# EAGLE design Apex_CV_Expander_3U_v1.0 (EAGLE 9.6.0)
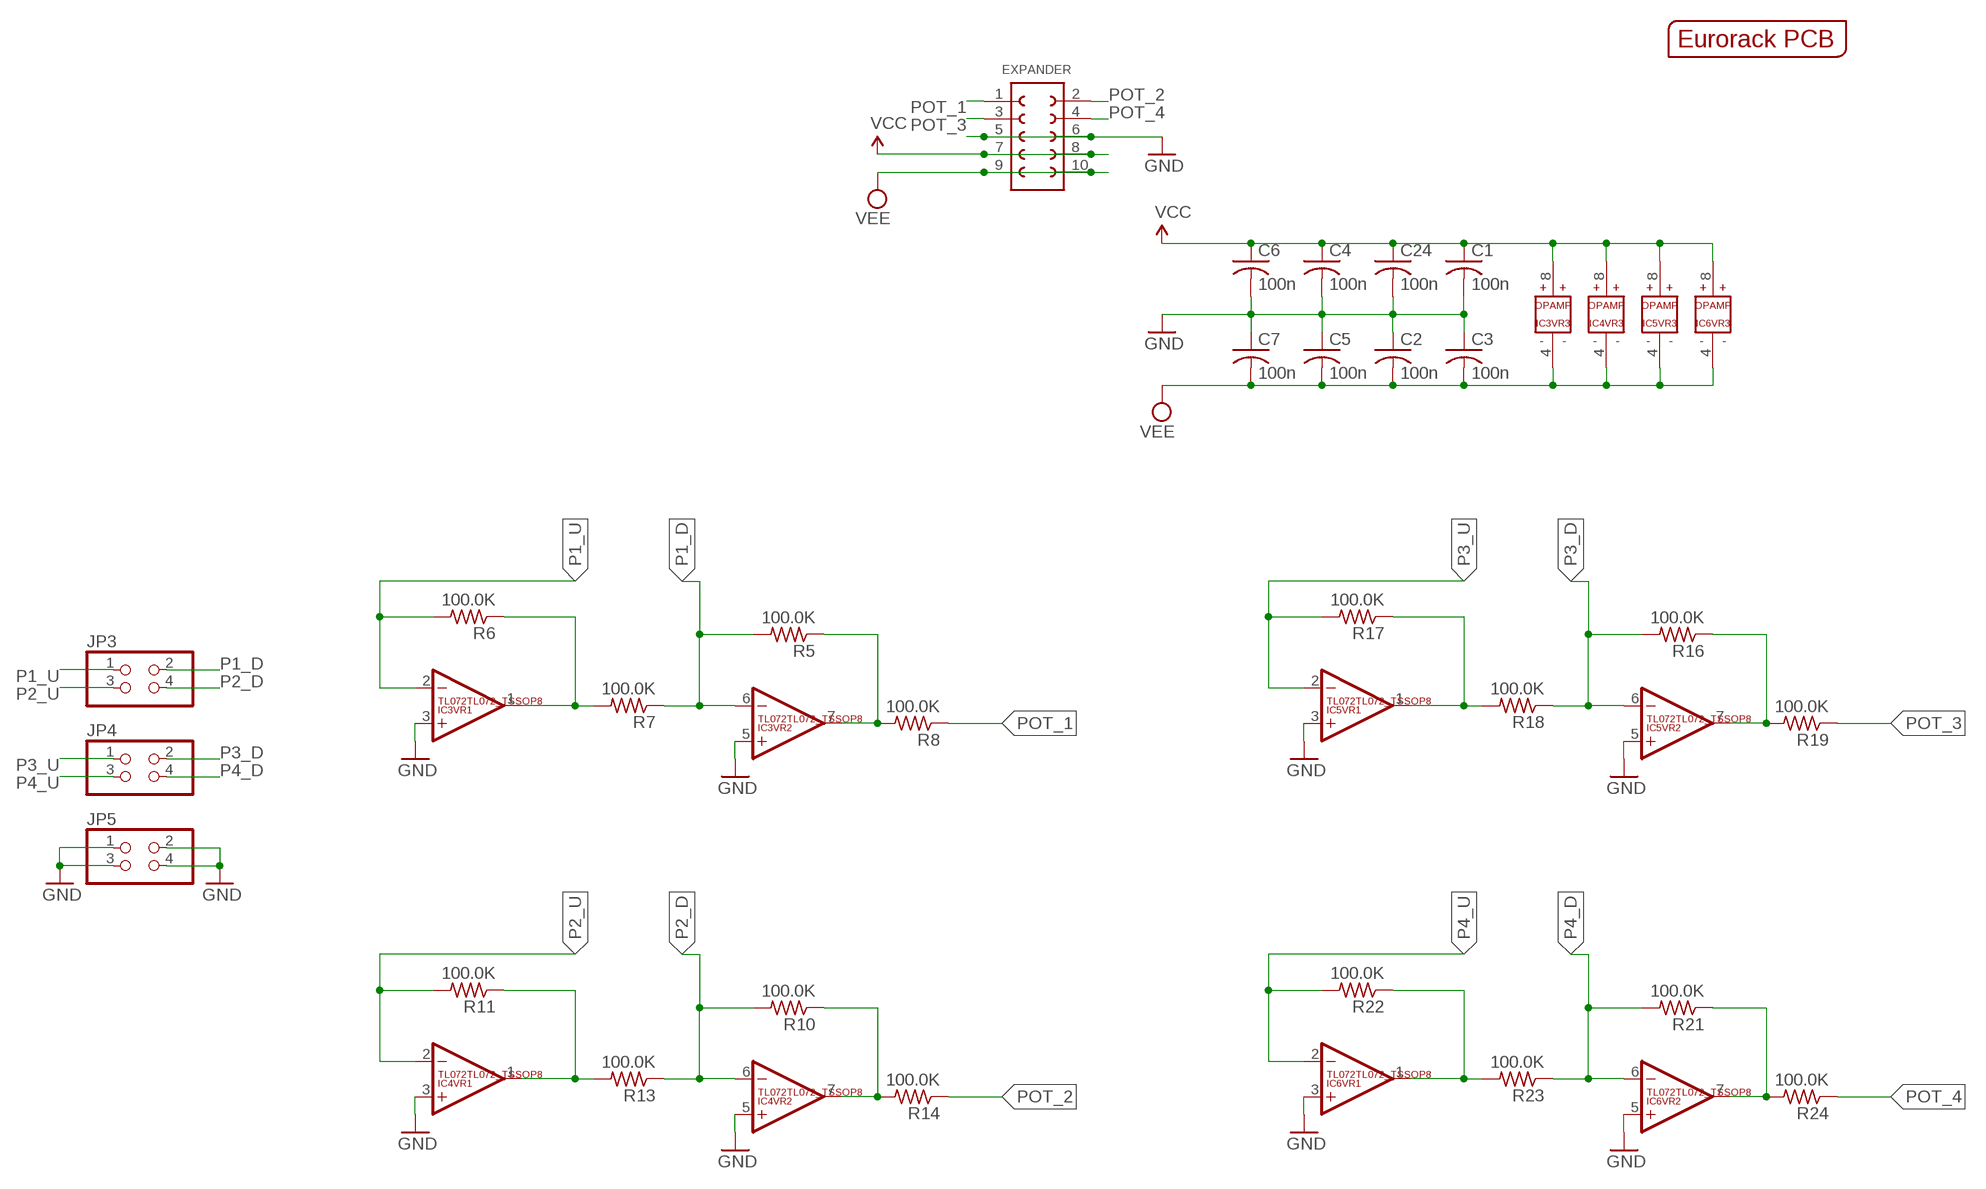
[diagram p0: schematic, sheet 1]

## Parts
C1  100n  C-USC0603  [C0603]
C2  100n  C-USC0603  [C0603]
C3  100n  C-USC0603  [C0603]
C4  100n  C-USC0603  [C0603]
C5  100n  C-USC0603  [C0603]
C6  100n  C-USC0603  [C0603]
C7  100n  C-USC0603  [C0603]
C24  100n  C-USC0603  [C0603]
EXPANDER  61301021121  [61301021121]
IC3  TL072TL072_TSSOP8  [TL072_TSSOP8]
IC4  TL072TL072_TSSOP8  [TL072_TSSOP8]
IC5  TL072TL072_TSSOP8  [TL072_TSSOP8]
IC6  TL072TL072_TSSOP8  [TL072_TSSOP8]
JP3  PINHD-2X2  [2X02]
JP4  PINHD-2X2  [2X02]
JP5  PINHD-2X2  [2X02]
PCB1  EURORACK_PCB2HP  [EURORACK2HPPCB]
R5  100.0K  R-US_R0603  [R0603]
R6  100.0K  R-US_R0603  [R0603]
R7  100.0K  R-US_R0603  [R0603]
R8  100.0K  R-US_R0603  [R0603]
R10  100.0K  R-US_R0603  [R0603]
R11  100.0K  R-US_R0603  [R0603]
R13  100.0K  R-US_R0603  [R0603]
R14  100.0K  R-US_R0603  [R0603]
R16  100.0K  R-US_R0603  [R0603]
R17  100.0K  R-US_R0603  [R0603]
R18  100.0K  R-US_R0603  [R0603]
R19  100.0K  R-US_R0603  [R0603]
R21  100.0K  R-US_R0603  [R0603]
R22  100.0K  R-US_R0603  [R0603]
R23  100.0K  R-US_R0603  [R0603]
R24  100.0K  R-US_R0603  [R0603]

## Nets
GND: C1.2 C2.1 C3.1 C4.2 C5.1 C6.2 C7.1 C24.2 EXPANDER.5 EXPANDER.6 IC3.3(VR1:+IN) IC3.5(VR2:+IN) IC4.3(VR1:+IN) IC4.5(VR2:+IN) IC5.3(VR1:+IN) IC5.5(VR2:+IN) IC6.3(VR1:+IN) IC6.5(VR2:+IN) JP5.1 JP5.2 JP5.3 JP5.4
N$4: IC3.7(VR2:OUT) R5.1 R8.2
N$6: IC3.1(VR1:OUT) R6.1 R7.2
N$10: IC4.7(VR2:OUT) R10.1 R14.2
N$12: IC4.1(VR1:OUT) R11.1 R13.2
N$16: IC5.7(VR2:OUT) R16.1 R19.2
N$18: IC5.1(VR1:OUT) R17.1 R18.2
N$22: IC6.7(VR2:OUT) R21.1 R24.2
N$24: IC6.1(VR1:OUT) R22.1 R23.2
P1_D: IC3.6(VR2:-IN) JP3.2 R5.2 R7.1
P1_U: IC3.2(VR1:-IN) JP3.1 R6.2
P2_D: IC4.6(VR2:-IN) JP3.4 R10.2 R13.1
P2_U: IC4.2(VR1:-IN) JP3.3 R11.2
P3_D: IC5.6(VR2:-IN) JP4.2 R16.2 R18.1
P3_U: IC5.2(VR1:-IN) JP4.1 R17.2
P4_D: IC6.6(VR2:-IN) JP4.4 R21.2 R23.1
P4_U: IC6.2(VR1:-IN) JP4.3 R22.2
POT_1: EXPANDER.1 R8.1
POT_2: EXPANDER.2 R14.1
POT_3: EXPANDER.3 R19.1
POT_4: EXPANDER.4 R24.1
VCC: C1.1 C4.1 C6.1 C24.1 EXPANDER.7 EXPANDER.8 IC3.8(VR3:V+) IC4.8(VR3:V+) IC5.8(VR3:V+) IC6.8(VR3:V+)
VEE: C2.2 C3.2 C5.2 C7.2 EXPANDER.9 EXPANDER.10 IC3.4(VR3:V-) IC4.4(VR3:V-) IC5.4(VR3:V-) IC6.4(VR3:V-)

## Library data of the parts
C1-C7 C24 = rcl:C-US: CAPACITOR, American symbol
EXPANDER = Wurth_Elektronik_Electromechanic_Board_to_Board_Connectors_rev18b:61301021121: WR-PHD 2.54mm Dual Pin Header, 10 Pins =>Code : Con_BTB_PHD_2.54_2_61301021121 <http://katalog.we-online.de/media/images/eican/Con_BTB_PHD_2.54_2_6130xx21121_pf2.jpg> Details see: http://katalog.we-online.de/en/em/613_0xx_211_21 Created 2014-05-29, Karrer Zheng 2014 (C) Würth Elektronik
IC3-IC6 = EurorackModularParts:TL072
JP3-JP5 = pinhead:PINHD-2X2: PIN HEADER
PCB1 = EurorackModularParts:EURORACK_PCB
R5-R8 R10 R11 R13 R14 R16-R19 R21-R24 = rcl:R-US_: RESISTOR, American symbol

## Board
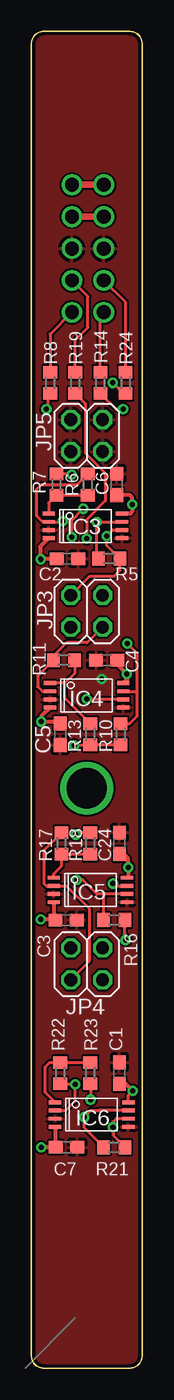
[diagram p1: board, top side]
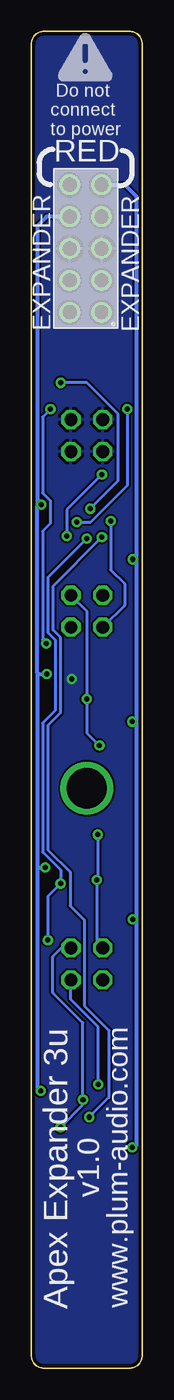
[diagram p2: board, bottom side, seen from below]

Size 8.82 x 106.5 mm. Coordinates in mm from the lower left corner, seen from the top.
Copper layers (1*16): Top 0.035mm / dielectric 1.5mm / Bottom 0.035mm
Design rules "default *": minimum track width 6mil, minimum drill 0.4mm, track to track 6mil, track to pad 6mil, pad to pad 6mil, via to via 6mil, smd to smd 6mil, copper to edge 10mil, drill to drill 6mil, minimum pad ring 10mil, minimum via ring 8mil, stop-mask expansion 4mil, vias tented up to drill 25mil, thermal gap 10mil

### Footprints (pad centres in the part's own frame; a part is rotated, then mirrored left to right if it is on the bottom)
C0603 = smd 1.1 x 1: 1 -0.85,0; 2 0.85,0
61301021121 = drill 1.1: 1 -5.08,-1.27; 2 -5.08,1.27; 3 -2.54,-1.27; 4 -2.54,1.27; 5 0,-1.27; 6 0,1.27; 7 2.54,-1.27; 8 2.54,1.27; 9 5.08,-1.27; 10 5.08,1.27
TL072_TSSOP8 = smd 0.305 x 0.991: 1 -0.975,-2.918; 2 -0.325,-2.918; 3 0.325,-2.918; 4 0.975,-2.918; 5 0.975,2.918; 6 0.325,2.918; 7 -0.325,2.918; 8 -0.975,2.918
2X02 = drill 1.016 octagon: 1 -1.27,-1.27; 2 -1.27,1.27; 3 1.27,-1.27; 4 1.27,1.27
R0603 = smd 1 x 1.1: 1 -0.85,0; 2 0.85,0

### Placement (x,y rotation side)
C1  7,23.5 90 top
C2  2.87,64.49 180 top
C3  2.77,35.7 180 top
C4  6,56.4 180 top
C5  2.3,50.5 90 top
C6  6.8,70.4 90 top
C7  2.8,17.6 180 top
C24  7.01,41.81 90 top
EXPANDER  4.5,89.2 90 bottom
IC3  4.3,67.1 270 top
IC4  4.4,53.6 270 top
IC5  4.7,38.1 270 top
IC6  4.8,20.2 270 top
JP3  4.4,60.3 0 top
JP4  4.4,32.2 0 top
JP5  4.4,74.3 0 top
PCB1  -0.5,0 0 top
R5  6.2,64.5 0 top
R6  4.5,70.4 90 top
R7  2,70.4 270 top
R8  1.5,78.5 270 top
R10  7.1,50.5 270 top
R11  2.6,56.4 180 top
R13  4.7,50.5 90 top
R14  5.5,78.5 270 top
R16  6.6,35.7 180 top
R17  2.4,41.8 90 top
R18  4.7,41.8 270 top
R19  3.5,78.5 270 top
R21  6.6,17.6 0 top
R22  2.3,23.5 270 top
R23  4.7,23.5 90 top
R24  7.5,78.5 270 top

### Tracks (layer width: path | path; a pad name or v marks a point on that pad's centre or on a via)
GND  (via drill 0.4)
  other vias: 5.6,54.9
  pour Bottom: 0,0 0,106.5 1.2,106.5 8.8,106.5 8.8,104.8 8.8,0
  pour Top: 0,0 0,106.5 1.2,106.5 8.8,106.5 8.8,104.8 8.8,0
N$1  (via drill 3.2)
  other vias: 4.4,46.2
N$4  (via drill 0.4)
  Top 0.254: R8.2 1.3,77.45 1.3,76.5 v1.2,76.4 | IC3.7 5.22,67.42 v5.2,67.4 5.2,64.65 R5.1
  Bottom 0.254: v1.2,76.4 1.2,70.3 4.1,67.4 v5.2,67.4
N$6
  Top 0.254: IC3.1 1.38,68.93 R7.2 R6.1
N$10  (via drill 0.4)
  Top 0.254: R14.2 6.75,76.4 v7.3,76.4 | v7.63,57.73 8.38,56.98 8.38,53.9 | 7.34,53.9 IC4.7 8.35,53.92 8.38,53.9 | 8.38,53.9 8.38,51.9 7.82,51.35 R10.1
  Bottom 0.254: v7.3,76.4 7.92,75.78 7.92,69.72 7.3,69.1 7.3,67.3 7.92,66.68 7.92,58.02 v7.63,57.73
N$12
  Top 0.254: R11.1 3.45,55.35 2.67,54.58 | 2.67,54.58 IC4.1 | R13.2 2.67,53.38 2.67,54.58
N$16  (via drill 0.4)
  Top 0.254: R19.2 4.3,76.85 4.3,72.9 5.9,71.3 5.9,69.1 4.4,67.6 v4.4,66.1 | v6.5,38.6 6.67,38.42 IC5.7 | v7.5,34.1 7.45,34.15 R16.1
  Bottom 0.254: v4.4,66.1 7.5,63 7.5,58.6 6.9,58 6.9,52.4 7.92,51.38 7.92,41.12 6.5,39.7 v6.5,38.6 7.5,37.6 v7.5,34.1
N$18
  Top 0.254: IC5.1 1.78,39.38 2.4,40 R17.1 R18.2
N$22  (via drill 0.4)
  Top 0.254: 5.5,17.85 R21.1 4.2,19.15 v4.2,20 4.72,20.52 5.4,20.52 | 5.4,20.52 IC6.7 6.97,20.52 | v3.2,66.2 3.2,67.53 v4.13,68.47 | v6.48,78.5 7.33,77.65 R24.2 | 5.5,20.43 5.4,20.52
  Bottom 0.254: v3.2,66.2 7.09,62.31 7.09,58.79 6.49,58.19 6.49,52.23 7.51,51.21 7.51,41.29 5.74,39.52 5.74,36.84 4.6,35.7 4.6,28.88 2.64,26.92 2.64,21.56 v4.2,20 | v4.13,68.47 1.91,70.69 1.91,76.01 4.4,78.5 v6.48,78.5
N$24
  Top 0.254: IC6.1 1.1,21.96 1.1,24 1.45,24.35 R22.1 R23.2
P1_D  (via drill 0.4)
  Top 0.254: IC3.6 6.47,66.78 v6,66.3 6,65.55 R5.2 7.05,63.55 6.6,63.1 4.66,63.1 JP3.2 | R7.1 3.15,71.25 v3.2,71.2
  Bottom 0.254: v3.2,71.2 6,68.4 v6,66.3
P1_U  (via drill 0.4)
  Top 0.254: 4.35,71.25 R6.2 3.65,70.4 0.8,70.4 0.44,70.04 0.44,67.9 0.92,67.42 IC3.2 2.42,67.42 v2.5,67.5
  Bottom 0.254: v2.5,67.5 2.5,63.6 1.4,62.5 1.4,60.76 JP3.1
P2_D  (via drill 0.4)
  Top 0.254: R10.2 R13.1 3.45,49.65 v3.4,49.6 | 7.29,53.3 IC4.6 4.42,53.27 v4.4,53.3
  Bottom 0.254: JP3.4 4.4,60.3 v4.4,53.3 4.4,50.6 v3.4,49.6
P2_U
  Top 0.254: JP3.3 4.44,57.8 2.8,57.8 1.75,56.75 R11.2 0.5,55.15 0.5,54.3 0.9,53.9 1.46,53.9 IC4.2
P3_D  (via drill 0.4)
  Top 0.254: R18.1 3.69,42.65 v3.54,42.5 | v3.6,38.9 4.1,38.9 5.22,37.77 5.8,37.77 | IC5.6 5.8,37.77 | 5.8,37.77 5.75,37.73 R16.2
  Bottom 0.254: v3.54,42.5 3.54,38.96 v3.6,38.9 3.6,33.94 JP4.2
P3_U
  Top 0.254: R17.2 1,41.25 1,38.6 1.2,38.4 1.76,38.4 IC5.2 2.77,38.42 4.63,36.57 4.63,32.43 JP4.1
P4_D  (via drill 0.4)
  Top 0.254: IC6.6 6.75,19.88 6.5,19.62 v6.5,19.2 6.5,18.55 R21.2 | R23.1 v4.71,21.39
  Bottom 0.254: v6.5,19.2 4.71,20.99 v4.71,21.39 4.71,27.51 7.1,29.9 7.1,32.8 6.43,33.47 JP4.4
P4_U  (via drill 0.4)
  Top 0.254: IC6.2 2.73,20.52 3.5,21.3 v3.5,22.6 3.45,22.65 R22.2 2.75,22.65
  Bottom 0.254: v3.5,22.6 3.5,27.2 5.67,29.37 JP4.3
POT_1
  Top 0.254: EXPANDER.1 1.5,82.39 R8.1
POT_2
  Top 0.254: R14.1 5.5,83.85 EXPANDER.2
POT_3
  Top 0.254: R19.1 3.5,81.9 4.5,82.9 4.5,85.39 EXPANDER.3
POT_4
  Top 0.254: R24.1 7.5,84.93 EXPANDER.4
VCC  (via drill 0.4)
  Top 0.254: IC6.8 7.72,21.71 v8.08,22.08
  Top 0.305: v8.08,22.08 7.51,22.65 C1.1 | C24.1 7.34,40.96 7.71,40.59 v7.71,39.89 v7.72,39.88 7.72,39.17 IC5.8 | C4.1 6.85,56.05 v7.6,55.3 7.6,54.86 IC4.8 | C6.1 7.85,69.55 8.02,69.38 v8.02,68.8 8.02,68.22 7.88,68.08 IC3.8
  Top 0.508: EXPANDER.7 EXPANDER.8
  Bottom 0.305: EXPANDER.8 7.61,91.74 8.35,91 8.35,68.7 | v8.08,22.08 8.35,22.35 8.35,39.95 | 8.35,55.4 8.35,68.7 | 8.35,55.4 8.35,39.95 | 8.35,39.95 8.29,39.89 v7.71,39.89 | 8.35,55.4 8.25,55.3 v7.6,55.3 | 8.35,68.7 8.25,68.8 v8.02,68.8
VEE  (via drill 0.4)
  Top 0.305: C7.2 1.8,17.6 | 1.8,17.6 v0.8,17.6 | v0.76,35.74 1.88,35.74 C3.2 1.78,35.84 IC5.4 | C5.2 2.15,51.5 v0.8,51.5 0.8,51.94 IC4.4 | v0.74,64.44 0.7,64.44 0.7,64.49 | 0.7,64.49 C2.2 | IC6.4 1.88,17.68 1.8,17.6 | IC3.4 0.7,65.44 0.7,64.49
  Top 0.508: EXPANDER.9 EXPANDER.10
  Bottom 0.305: EXPANDER.9 1.38,94.28 0.47,93.37 0.47,64.7 | 0.47,64.7 0.47,51.5 | 0.47,51.5 0.47,35.74 | 0.47,35.74 0.47,17.73 0.6,17.6 v0.8,17.6 | 0.47,35.74 v0.76,35.74 | 0.47,51.5 v0.8,51.5 | 0.47,64.7 0.48,64.7 v0.74,64.44

### Text on the board
bPlace: Do not / connect / to power | RED | EXPANDER | www.plum-audio.com | v1.0 | Apex Expander 3u